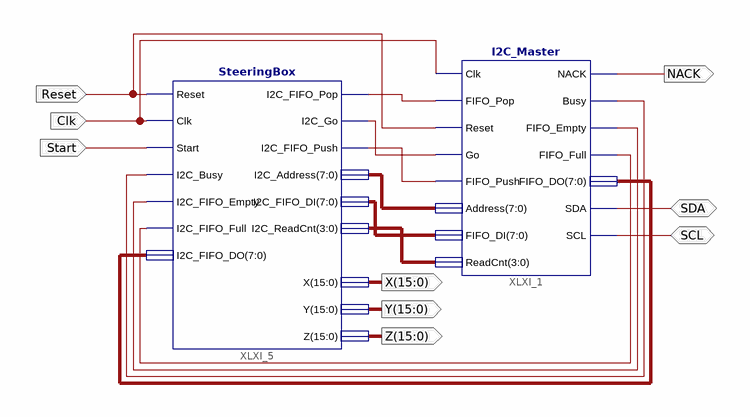
[diagram p0: schematic sheet 1]
// Xilinx ISE schematic scheme_1.sch (artix7) as structural Verilog: 2 symbols, 9 ports
module scheme_1 (
  input  Reset,
  input  Clk,
  input  Start,
  inout  SDA,
  inout  SCL,
  output NACK,
  output [15:0] X,
  output [15:0] Y,
  output [15:0] Z
);

  wire I2C_BUSY, I2C_GO, XLXN_67, XLXN_69, XLXN_71, XLXN_72;
  wire [3:0] XLXN_66;
  wire [7:0] I2C_ADDRESS, XLXN_16, XLXN_65;

  SteeringBox XLXI_5 (
    .Reset(Reset), .Clk(Clk), .Start(Start), .I2C_Busy(I2C_BUSY), .I2C_FIFO_Empty(XLXN_71),
    .I2C_FIFO_Full(XLXN_72), .I2C_FIFO_DO(XLXN_16), .I2C_FIFO_Pop(XLXN_67), .I2C_Go(I2C_GO),
    .I2C_FIFO_Push(XLXN_69), .I2C_Address(I2C_ADDRESS), .I2C_FIFO_DI(XLXN_65), .I2C_ReadCnt(XLXN_66), .X(X),
    .Y(Y), .Z(Z));
  I2C_Master XLXI_1 (
    .Clk(Clk), .FIFO_Pop(XLXN_67), .Reset(Reset), .Go(I2C_GO), .FIFO_Push(XLXN_69), .Address(I2C_ADDRESS),
    .FIFO_DI(XLXN_65), .ReadCnt(XLXN_66), .SDA(SDA), .SCL(SCL), .NACK(NACK), .Busy(I2C_BUSY),
    .FIFO_Empty(XLXN_71), .FIFO_Full(XLXN_72), .FIFO_DO(XLXN_16));
endmodule
